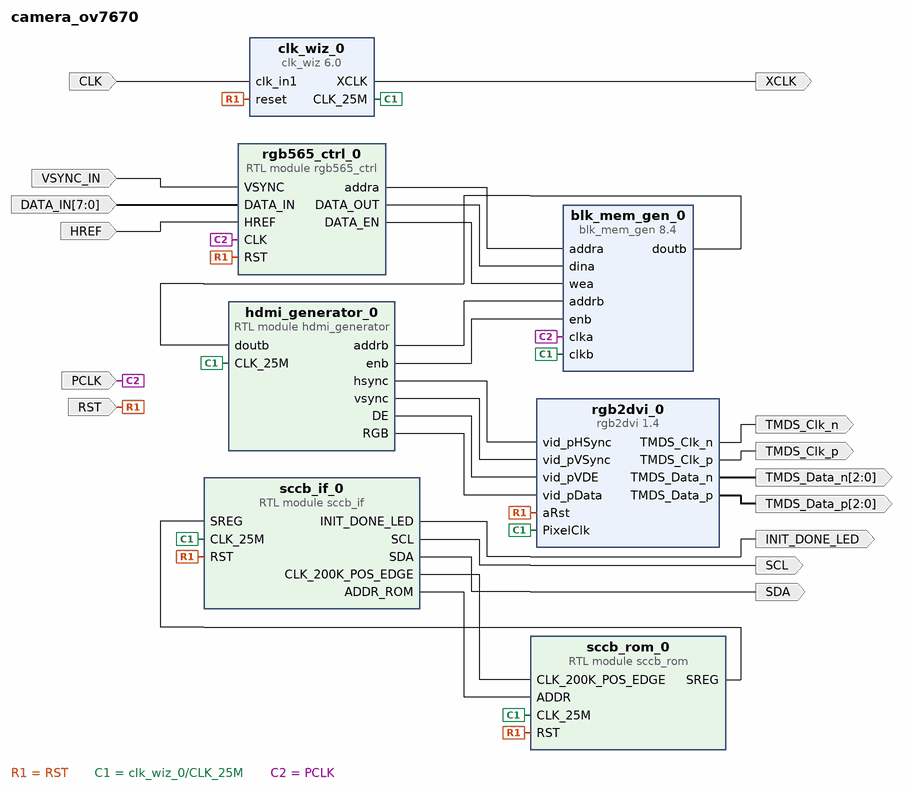
[diagram p0: block diagram of the top level]
# Vivado block design camera_ov7670, xc7z010clg400-1, Vivado 2018.2
create_bd_design camera_ov7670

create_bd_port -dir I CLK
create_bd_port -dir I RST
create_bd_port -dir O -type clk XCLK
create_bd_port -dir O SDA
create_bd_port -dir O SCL
create_bd_port -dir O INIT_DONE_LED
create_bd_port -dir I PCLK
create_bd_port -dir I VSYNC_IN
create_bd_port -dir I -from 7 -to 0 DATA_IN
create_bd_port -dir I HREF
create_bd_port -dir O -type clk TMDS_Clk_p
create_bd_port -dir O -type clk TMDS_Clk_n
create_bd_port -dir O -from 2 -to 0 TMDS_Data_p
create_bd_port -dir O -from 2 -to 0 TMDS_Data_n

create_bd_cell -type ip -vlnv xilinx.com:ip:clk_wiz:6.0 clk_wiz_0
set_property -dict [list \
  CONFIG.CLKIN1_JITTER_PS 80.0 \
  CONFIG.CLKOUT2_USED true \
  CONFIG.CLKOUT3_USED true \
  CONFIG.NUM_OUT_CLKS 3 \
  CONFIG.CLK_OUT1_PORT CLK_50M \
  CONFIG.CLK_OUT2_PORT CLK_25M \
  CONFIG.CLK_OUT3_PORT XCLK \
  CONFIG.CLKOUT1_REQUESTED_OUT_FREQ 50.000 \
  CONFIG.CLKOUT2_REQUESTED_OUT_FREQ 25.000 \
  CONFIG.CLKOUT3_REQUESTED_OUT_FREQ 24.000 \
  CONFIG.USE_LOCKED false \
  CONFIG.MMCM_DIVCLK_DIVIDE 5 \
  CONFIG.MMCM_CLKFBOUT_MULT_F 24.000 \
  CONFIG.MMCM_CLKIN1_PERIOD 8.0 \
  CONFIG.MMCM_CLKIN2_PERIOD 10.0 \
  CONFIG.MMCM_CLKOUT0_DIVIDE_F 12.000 \
  CONFIG.MMCM_CLKOUT1_DIVIDE 24 \
  CONFIG.MMCM_CLKOUT2_DIVIDE 25 \
  CONFIG.CLK_IN1_BOARD_INTERFACE sys_clock \
  CONFIG.CLKOUT1_JITTER 360.992 \
  CONFIG.CLKOUT1_PHASE_ERROR 335.459 \
  CONFIG.CLKOUT2_JITTER 411.350 \
  CONFIG.CLKOUT2_PHASE_ERROR 335.459 \
  CONFIG.CLKOUT3_JITTER 414.490 \
  CONFIG.CLKOUT3_PHASE_ERROR 335.459 \
] [get_bd_cells clk_wiz_0]
create_bd_cell -type ip -vlnv xilinx.com:ip:blk_mem_gen:8.4 blk_mem_gen_0
set_property -dict [list \
  CONFIG.Memory_Type Simple_Dual_Port_RAM \
  CONFIG.Enable_32bit_Address false \
  CONFIG.Use_Byte_Write_Enable false \
  CONFIG.Write_Width_A 16 \
  CONFIG.Write_Depth_A 65536 \
  CONFIG.Operating_Mode_A WRITE_FIRST \
  CONFIG.Enable_A Always_Enabled \
  CONFIG.Write_Width_B 16 \
  CONFIG.Read_Width_B 16 \
  CONFIG.Enable_B Use_ENB_Pin \
  CONFIG.Register_PortB_Output_of_Memory_Primitives true \
  CONFIG.Port_B_Clock 100 \
  CONFIG.Port_B_Enable_Rate 100 \
  CONFIG.use_bram_block Stand_Alone \
] [get_bd_cells blk_mem_gen_0]
create_bd_cell -type ip -vlnv digilentinc.com:ip:rgb2dvi:1.4 rgb2dvi_0
set_property -dict {CONFIG.kClkPrimitive MMCM CONFIG.kClkRange 5} [get_bd_cells rgb2dvi_0]
create_bd_cell -type module -reference sccb_if sccb_if_0
create_bd_cell -type module -reference sccb_rom sccb_rom_0
create_bd_cell -type module -reference rgb565_ctrl rgb565_ctrl_0
create_bd_cell -type module -reference hdmi_generator hdmi_generator_0

# ---- connections ----

connect_bd_net [get_bd_ports CLK] [get_bd_pins clk_wiz_0/clk_in1]
connect_bd_net [get_bd_ports RST] \
  [get_bd_pins clk_wiz_0/reset] [get_bd_pins rgb2dvi_0/aRst] [get_bd_pins sccb_if_0/RST] [get_bd_pins sccb_rom_0/RST] \
  [get_bd_pins rgb565_ctrl_0/RST]
connect_bd_net [get_bd_pins clk_wiz_0/CLK_25M] \
  [get_bd_pins rgb2dvi_0/PixelClk] [get_bd_pins blk_mem_gen_0/clkb] [get_bd_pins sccb_if_0/CLK_25M] \
  [get_bd_pins sccb_rom_0/CLK_25M] [get_bd_pins hdmi_generator_0/CLK_25M]
connect_bd_net [get_bd_pins clk_wiz_0/XCLK] [get_bd_ports XCLK]
connect_bd_net [get_bd_pins sccb_rom_0/SREG] [get_bd_pins sccb_if_0/SREG]
connect_bd_net [get_bd_pins sccb_if_0/CLK_200K_POS_EDGE] [get_bd_pins sccb_rom_0/CLK_200K_POS_EDGE]
connect_bd_net [get_bd_pins sccb_if_0/ADDR_ROM] [get_bd_pins sccb_rom_0/ADDR]
connect_bd_net [get_bd_pins sccb_if_0/SDA] [get_bd_ports SDA]
connect_bd_net [get_bd_pins sccb_if_0/SCL] [get_bd_ports SCL]
connect_bd_net [get_bd_pins sccb_if_0/INIT_DONE_LED] [get_bd_ports INIT_DONE_LED]
connect_bd_net [get_bd_ports PCLK] [get_bd_pins blk_mem_gen_0/clka] [get_bd_pins rgb565_ctrl_0/CLK]
connect_bd_net [get_bd_pins blk_mem_gen_0/doutb] [get_bd_pins hdmi_generator_0/doutb]
connect_bd_net [get_bd_pins hdmi_generator_0/addrb] [get_bd_pins blk_mem_gen_0/addrb]
connect_bd_net [get_bd_pins hdmi_generator_0/enb] [get_bd_pins blk_mem_gen_0/enb]
connect_bd_net [get_bd_pins rgb565_ctrl_0/addra] [get_bd_pins blk_mem_gen_0/addra]
connect_bd_net [get_bd_pins rgb565_ctrl_0/DATA_OUT] [get_bd_pins blk_mem_gen_0/dina]
connect_bd_net [get_bd_pins rgb565_ctrl_0/DATA_EN] [get_bd_pins blk_mem_gen_0/wea]
connect_bd_net [get_bd_ports VSYNC_IN] [get_bd_pins rgb565_ctrl_0/VSYNC]
connect_bd_net [get_bd_ports DATA_IN] [get_bd_pins rgb565_ctrl_0/DATA_IN]
connect_bd_net [get_bd_ports HREF] [get_bd_pins rgb565_ctrl_0/HREF]
connect_bd_net [get_bd_pins hdmi_generator_0/hsync] [get_bd_pins rgb2dvi_0/vid_pHSync]
connect_bd_net [get_bd_pins hdmi_generator_0/vsync] [get_bd_pins rgb2dvi_0/vid_pVSync]
connect_bd_net [get_bd_pins hdmi_generator_0/DE] [get_bd_pins rgb2dvi_0/vid_pVDE]
connect_bd_net [get_bd_pins hdmi_generator_0/RGB] [get_bd_pins rgb2dvi_0/vid_pData]
connect_bd_net [get_bd_pins rgb2dvi_0/TMDS_Clk_p] [get_bd_ports TMDS_Clk_p]
connect_bd_net [get_bd_pins rgb2dvi_0/TMDS_Clk_n] [get_bd_ports TMDS_Clk_n]
connect_bd_net [get_bd_pins rgb2dvi_0/TMDS_Data_p] [get_bd_ports TMDS_Data_p]
connect_bd_net [get_bd_pins rgb2dvi_0/TMDS_Data_n] [get_bd_ports TMDS_Data_n]

validate_bd_design
save_bd_design
